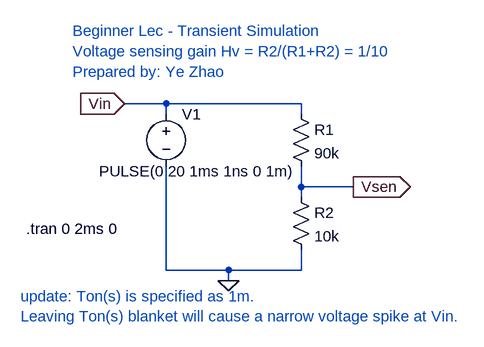
[diagram p0: schematic LTspice 02-1 tran_update.asc]
LTspice 02-1 tran_update.asc, the LTspice schematic file:
Version 4
SHEET 1 920 680
WIRE 400 192 336 192
WIRE 608 192 400 192
WIRE 400 208 400 192
WIRE 608 208 608 192
WIRE 608 320 608 288
WIRE 688 320 608 320
WIRE 608 336 608 320
WIRE 400 448 400 288
WIRE 496 448 400 448
WIRE 608 448 608 416
WIRE 608 448 496 448
WIRE 496 464 496 448
FLAG 496 464 0
FLAG 688 320 Vsen
IOPIN 688 320 Out
FLAG 336 192 Vin
IOPIN 336 192 In
SYMBOL voltage 400 192 R0
WINDOW 123 0 0 Left 2
WINDOW 39 0 0 Left 2
WINDOW 3 -103 104 Left 2
SYMATTR Value PULSE(0 20 1ms 1ns 0 1m)
SYMATTR InstName V1
SYMBOL res 592 192 R0
SYMATTR InstName R1
SYMATTR Value 90k
SYMBOL res 592 320 R0
SYMATTR InstName R2
SYMATTR Value 10k
TEXT 184 384 Left 2 !.tran 0 2ms 0
TEXT 256 80 Left 2 ;Beginner Lec - Transient Simulation\nVoltage sensing gain Hv = R2/(R1+R2) = 1/10\nPrepared by: Ye Zhao
TEXT 176 488 Left 2 ;update: Ton(s) is specified as 1m. \nLeaving Ton(s) blanket will cause a narrow voltage spike at Vin.

The netlist it stands for:
* LTspice 02-1 tran_update.asc
V1 Vin 0 PULSE(0 20 1ms 1ns 0 1m)
R1 Vin Vsen 90k
R2 Vsen 0 10k
.tran 0 2ms 0
* Beginner Lec - Transient Simulation
* Voltage sensing gain Hv = R2/(R1+R2) = 1/10
* Prepared by: Ye Zhao
* update: Ton(s) is specified as 1m.
* Leaving Ton(s) blanket will cause a narrow voltage spike at Vin.
.backanno
.end